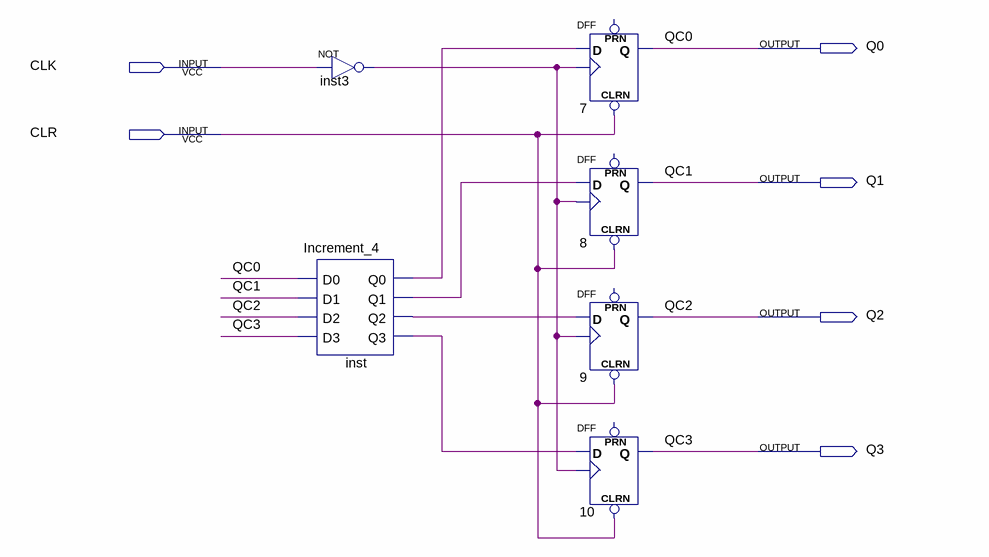
[diagram p0: schematic sheet]
// Quartus schematic Counter_4b.bdf as structural Verilog: 6 symbols, 6 pins
module Counter_4b (
  input  CLK,
  input  CLR,
  output Q0,
  output Q1,
  output Q2,
  output Q3
);

  wire inst3_out, inst_q0, inst_q1, inst_q2, inst_q3;

  not inst3 (inst3_out, CLK);
  Increment_4 inst (.D0(Q0), .D1(Q1), .D2(Q2), .D3(Q3), .Q0(inst_q0), .Q1(inst_q1), .Q2(inst_q2), .Q3(inst_q3));
  DFF u_7 (.CLRN(CLR), .CLK(inst3_out), .D(inst_q0), .Q(Q0));  // open: PRN
  DFF u_8 (.CLRN(CLR), .CLK(inst3_out), .D(inst_q1), .Q(Q1));  // open: PRN
  DFF u_9 (.CLRN(CLR), .CLK(inst3_out), .D(inst_q2), .Q(Q2));  // open: PRN
  DFF u_10 (.CLRN(CLR), .CLK(inst3_out), .D(inst_q3), .Q(Q3));  // open: PRN

  // Other names for the same wires on the sheet: QC0 = Q0; QC1 = Q1; QC2 = Q2; QC3 = Q3
endmodule
